# Altium project roomba-dock.PrjPcb
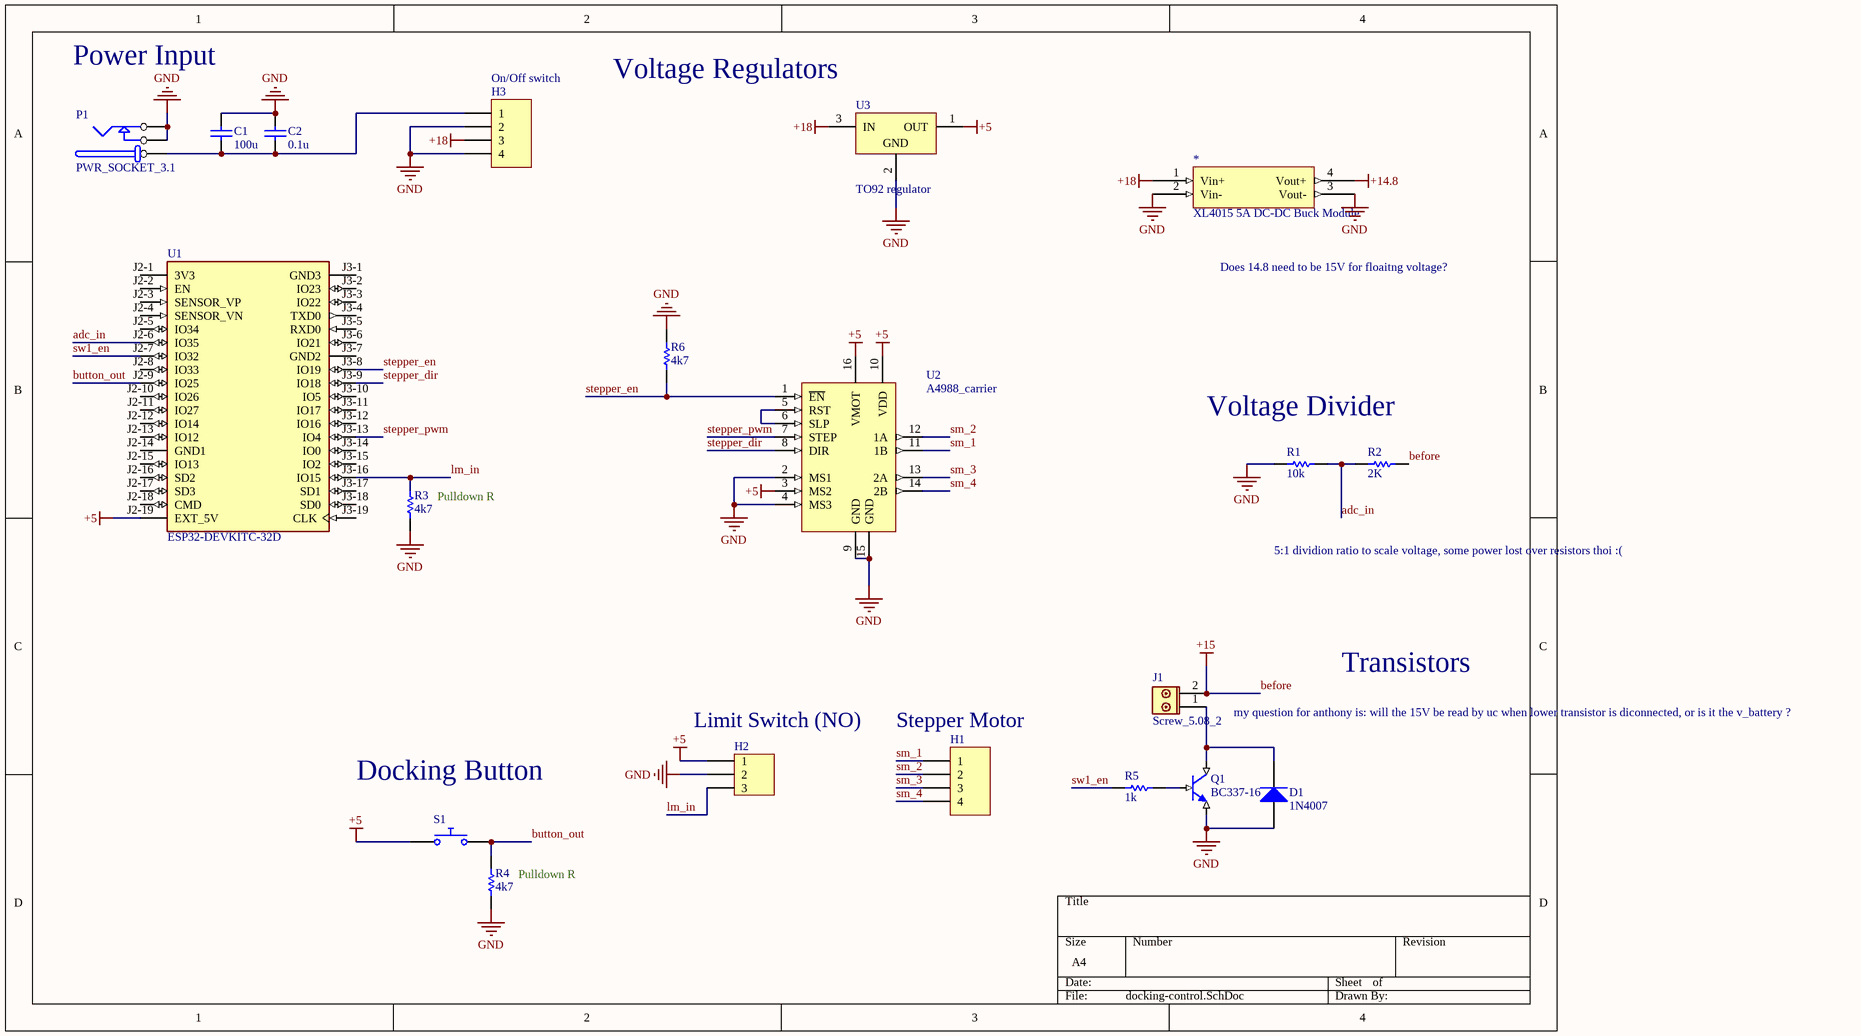
[diagram p0: docking-control.SchDoc]
1 sheet, 20 parts. Net scope: global (net labels, ports and power ports of the same name join across sheets).
Board file: docking-control.PcbDoc

## Sheet docking-control.SchDoc
size A4; SheetNumber: 1; SheetTotal: 1; SPICEModelCacheVAMPCBID: <root> / <DocumentId>VAMPCBID</DocumentId> / <CacheFrame Number="0"> / <Model Name="bc337-16" Kind="MDL"> / <Text>*BC337-16 MCE 5-20-97 / *Ref: Motorola Small-Signal Device Databook, Q4/94 / *Si 625mW 45V 800mA 210MHz Amp pkg:TO-92B 3,2,1 / .MODEL BC337-16 NPN (IS=81.2F NF=1 BF=208 VAF=121 IKF=0.48 ISE=50.4P NE=2 / + BR=4 NR=1 VAR=20 IKR=0.72 RE=64.4M RB=0.258 RC=25.8M XTB=1.5 / + CJE=89.5P VJE=1.1 MJE=0.5 CJC=28.9P VJC=0.3 MJC=0.3 TF=757P TR=526N)</Text> / </Model> / <Model Name="1n4007" Kind="MDL"> / <Text>*1N4007 MCE 8-16-95 / *1000V 1A Si GenPurpose Diode pkg:DIODE0.4 1,2 / .MODEL 1N4007 D(IS=2.55E-9 RS=0.042 N=1.75 TT=5.76E-6 CJO=1.85E-11 / + VJ=0.75 M=0.333 BV=1000 IBV=9.86E-5 )</Text> / </Model> / </CacheFrame> / </root>

### Parts
*  XL4015 5A DC-DC Buck Module  [XL4015 5A DC-DC Buck Module-Footprint-1]
C1  value 100u  [RAD200_A]  (hidden comment: Cap)
C2  value 0.1u  [RAD200_A]  (hidden comment: Cap)
D1  1N4007  [DIODE400]
H1  Header 4  [HDR1X4]  (value not drawn)
H2  Header 3  [HDR1X3]  (value not drawn)
H3  Header 4  [HDR1X4]  (value not drawn)
J1  Screw_5.08_2  [ScrewTerm_2.54_2]
P1  PWR_SOCKET_3.1  [PWR_SOCKET_3.1]
Q1  BC337-16  [TO-92A]
R1  value 10k  (hidden comment: Resistor)
R2  value 2K  (hidden comment: Resistor)
R3  value 4k7  (hidden comment: Resistor)
R4  value 4k7  (hidden comment: Resistor)
R5  value 1k  [AXIAL400]  (hidden comment: Res)
R6  value 4k7  [AXIAL400]  (hidden comment: Res)
S1  Push Button Normally Opened  (value not drawn)
U1  ESP32-DEVKITC-32D  [MODULE_ESP32-DEVKITC-32D]
U2  A4988_carrier  [DIP-16x500]
U3  TO92 regulator  [TO-92A]

### Nets
+5: H2.1 S1.1 U1.J2-19(EXT_5V) U2.3(MS2) U2.10(VDD) U2.16(VMOT) U3.1(OUT)
+14.8: *.4(Vout+)
+18: *.1(Vin+) H3.3 U3.3(IN)
before: J1.2 R2.1  [also labelled +15]
GND: *.2(Vin-) *.3(Vout-) C1.2 C2.2 D1.1(A) H2.2 H3.2 H3.4 P1.2(B) P1.3(C) Q1.3(E) R1.2 R3.2 R4.2 R6.2 U2.2(MS1) U2.4(MS3) U2.9(GND) U2.15(GND) U3.2(GND)
adc_in: R1.1 R2.2 U1.J2-6(IO35)
button_out: R4.1 S1.2 U1.J2-9(IO25)
lm_in: H2.3 R3.1 U1.J3-16(IO15)
sm_1: H1.1 U2.11(1B)
sm_2: H1.2 U2.12(1A)
sm_3: H1.3 U2.13(2A)
sm_4: H1.4 U2.14(2B)
stepper_dir: U1.J3-9(IO18) U2.8(DIR)
stepper_en: R6.1 U1.J3-8(IO19) U2.1(~{EN})
stepper_pwm: U1.J3-13(IO4) U2.7(STEP)
sw1_en: R5.1 U1.J2-7(IO32)
NetC1_1: C1.1 C2.1 H3.1 P1.1(A)
NetD1_2: D1.2(K) J1.1 Q1.1(C)
NetQ1_2: Q1.2(B) R5.2
NetU2_5: U2.5(RST) U2.6(SLP)

Not connected (* = marked no-connect by the designer): U1 J2-1(3V3) J2-2(EN) J2-3(SENSOR_VP) J2-4(SENSOR_VN) J2-5(IO34) J2-8(IO33) J2-10(IO26) J2-11(IO27) J2-12(IO14) J2-13(IO12) J2-14(GND1) J2-15(IO13) J2-16(SD2) J2-17(SD3) J2-18(CMD) J3-1(GND3) J3-2(IO23) J3-3(IO22) J3-4(TXD0) J3-5(RXD0) J3-6(IO21) J3-7(GND2) J3-10(IO5) J3-11(IO17) J3-12(IO16) J3-14(IO0) J3-15(IO2) J3-17(SD1) J3-18(SD0) J3-19(CLK)

### Notes on the sheet
- Power Input
- (near H3) On/Off switch
- (near U3) Voltage Regulators
- Does 14.8 need to be 15V for floaitng voltage?
- Voltage Divider
- (near R3) Pulldown R
- 5:1 dividion ratio to scale voltage, some power lost over resistors thoi :(
- my question for anthony is: will the 15V be read by uc when lower transistor is diconnected, or is it the v_battery ?
- Transistors
- Docking Button
- (near H2) Limit Switch (NO)
- (near H1) Stepper Motor
- (near R4) Pulldown R

### Library data of the parts
* = CMP-00030-00002-1
C1 C2 = Cap: Capacitor; Manufacturer: Generic Components; Class: Passive; Published: 08/06/2000; Publisher: Altium Hobart Technology Centre; SubClass: Capacitor
D1 = 1N4007: 1.0 Ampere General Purpose Rectifier; Manufacturer: Fairchild Semiconductor; Revised: 11-July-2000: SIM Model Added.; Class: Discrete; SubClass: Rectifier - Standard Recovery; Published: 8/06/2000; Publisher: Altium Hobart Technology Centre
H1 H3 = Header 4: Header, 4-Pin; Manufacturer: Generic Components; Class: Connector
H2 = Header 3: Header, 3-Pin; Manufacturer: Generic Components; Class: Connector
J1 = Screw_5.08_2: 2 way screw terminal connector
Q1 = BC337-16: NPN BJT
R1-R4 = Resistor: TC1: 0; SimulationGenericComponent: True; TC2: 0
R5 R6 = Res: Resistor; Manufacturer: Generic Components; Class: Passive; Published: 08/06/2000; Publisher: Altium Hobart Technology Centre; SubClass: Resistor
S1 = Push Button NO: closed: 0; Rclosed: 1m; Ropen: 1Meg; SimulationGenericComponent: True
U1 = ESP32-DEVKITC-32D: WiFi Development Tools (802.11) ESP32 General Development Kit, ESP32-WROOM-32D on the board; MF: Espressif Systems; SnapEDA_Link: https://www.snapeda.com/parts/ESP32-DEVKITC-32D/Espressif+Systems/view-part/?ref=snap; Package: None; Value: *; MP: ESP32-DEVKITC-32D; Check_prices: https://www.snapeda.com/parts/ESP32-DEVKITC-32D/Espressif+Systems/view-part/?ref=eda
U2 = A4988_carrier: Carrier pcb for A4988 stepper driver
U3 = REG_TO92: Positive Regulator  3.3V, 5V; PackageDocument: revC; Published: 8-Jun-2000; LatestRevisionDate: 17-Jul-2002; LatestRevisionNote: Re-released for DXP Platform.; DatasheetDocument: Sep-1997; PackageReference: ZZ311; Publisher: Altium Limited; ComponentLink1Description: Manufacturer Link; ComponentLink1URL: http://www.ti.com/